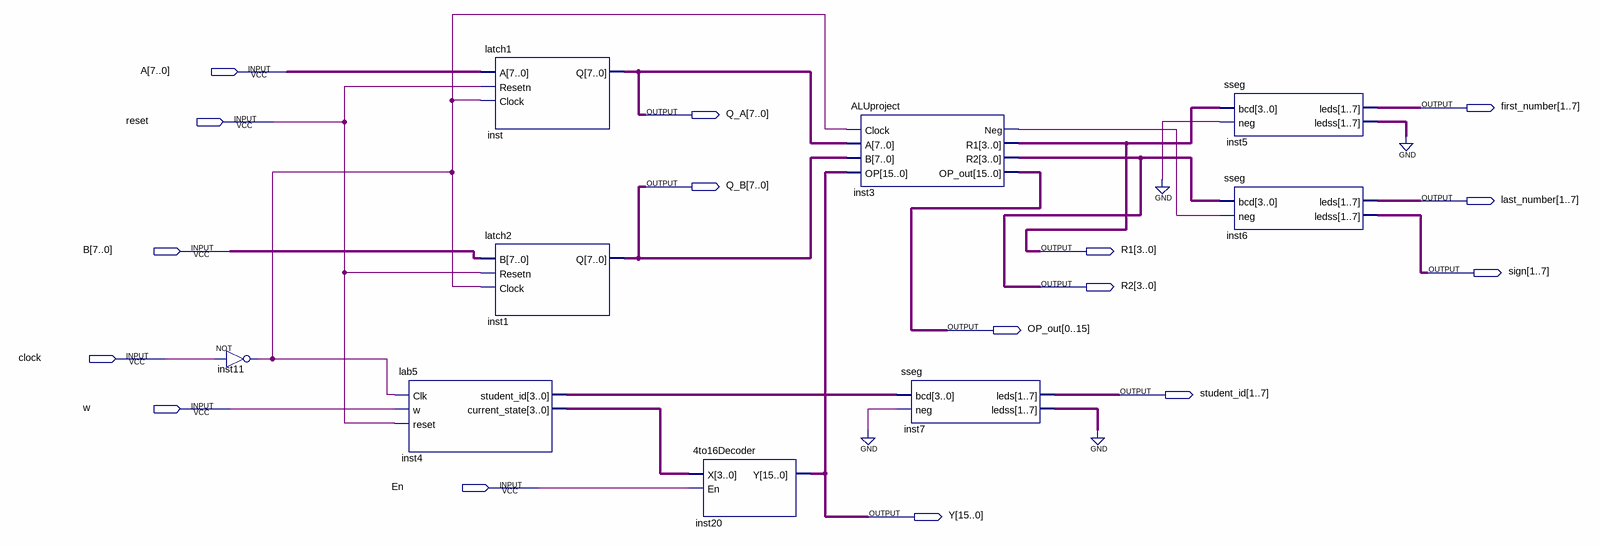
[diagram p0: schematic sheet]
// Quartus schematic GPU.bdf as structural Verilog: 9 symbols, 16 pins
module GPU (
  input  [7:0] A,
  input  reset,
  input  [7:0] B,
  input  clock,
  input  w,
  input  En,
  output [1:7] first_number,
  output [7:0] Q_A,
  output [7:0] Q_B,
  output [1:7] last_number,
  output [3:0] R1,
  output [1:7] sign,
  output [3:0] R2,
  output [0:15] OP_out,
  output [1:7] student_id,
  output [15:0] Y
);

  wire inst3_neg, inst11_out;
  wire [3:0] inst4_current_state, inst4_student_id;
  wire [6:0] inst5_ledss, inst7_ledss;

  not inst11 (inst11_out, clock);
  lab5 inst4 (
    .Clk(inst11_out), .w(w), .reset(reset), .student_id(inst4_student_id), .current_state(inst4_current_state));
  latch1 inst (.A(A), .Resetn(reset), .Clock(inst11_out), .Q(Q_A));
  latch2 inst1 (.B(B), .Resetn(reset), .Clock(inst11_out), .Q(Q_B));
  \4to16Decoder  inst20 (.X(inst4_current_state), .En(En), .Y(Y));
  ALUproject inst3 (.Clock(inst11_out), .A(Q_A), .B(Q_B), .OP(Y), .Neg(inst3_neg), .R1(R1), .R2(R2), .OP_out(OP_out));
  sseg inst7 (.bcd(inst4_student_id), .neg(1'b0), .leds(student_id), .ledss(inst7_ledss));
  sseg inst5 (.bcd(R1), .neg(1'b0), .leds(first_number), .ledss(inst5_ledss));
  sseg inst6 (.bcd(R2), .neg(inst3_neg), .leds(last_number), .ledss(sign));
  // also tied to GND on the sheet: {inst7_ledss[0], inst7_ledss[1], inst7_ledss[2], inst7_ledss[3], inst7_ledss[4], inst7_ledss[5], inst7_ledss[6], inst5_ledss[0], inst5_ledss[1], inst5_ledss[2], inst5_ledss[3], inst5_ledss[4], inst5_ledss[5], inst5_ledss[6]}
endmodule
